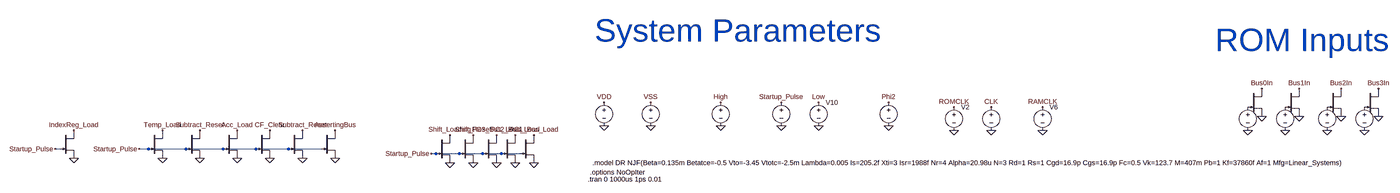
[diagram p0: schematic controls.asc, whole sheet]
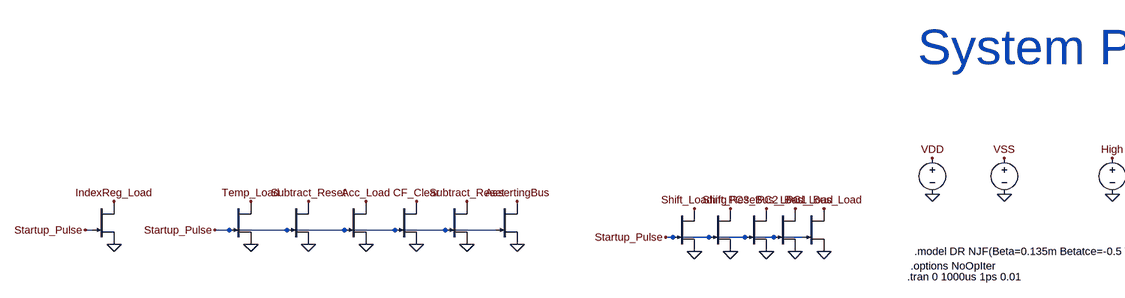
[diagram p1: schematic controls.asc, part, row 1 of 1, column 1 of 2]
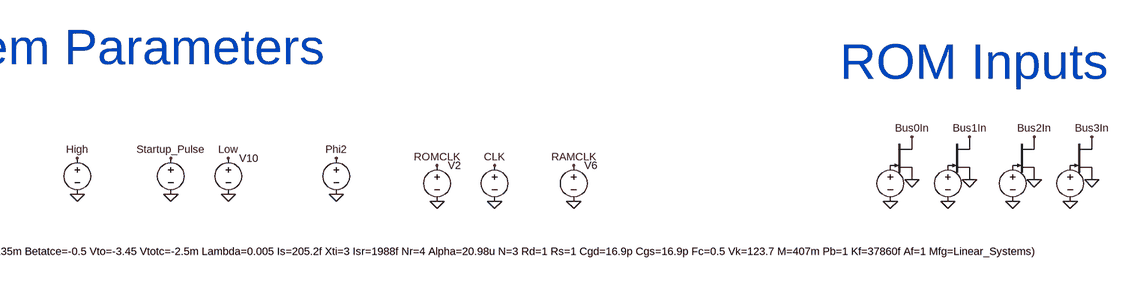
[diagram p2: schematic controls.asc, part, row 1 of 1, column 2 of 2]
controls.asc, the LTspice schematic file:
Version 4.1
SHEET 1 109444 42780
WIRE 6160 -9552 6144 -9552
WIRE 6464 -9552 6432 -9552
WIRE 6592 -9552 6464 -9552
WIRE 6720 -9552 6592 -9552
WIRE 6832 -9552 6720 -9552
WIRE 6944 -9552 6832 -9552
WIRE 7056 -9552 6944 -9552
WIRE 7488 -9536 7472 -9536
WIRE 7568 -9536 7488 -9536
WIRE 7648 -9536 7568 -9536
WIRE 7712 -9536 7648 -9536
WIRE 7776 -9536 7712 -9536
FLAG 8768 -9632 0
FLAG 8608 -9712 VDD
FLAG 8608 -9632 0
FLAG 8768 -9712 VSS
FLAG 6432 -9552 Startup_Pulse
FLAG 6512 -9616 Temp_Load
FLAG 6768 -9616 Acc_Load
FLAG 6880 -9616 CF_Clear
FLAG 6640 -9616 Subtract_Reset
FLAG 6768 -9520 0
FLAG 6512 -9520 0
FLAG 6880 -9520 0
FLAG 6640 -9520 0
FLAG 9008 -9632 0
FLAG 9008 -9712 High
FLAG 6992 -9616 Subtract_Reset
FLAG 6992 -9520 0
FLAG 7104 -9616 AssertingBus
FLAG 7104 -9520 0
FLAG 7472 -9536 Startup_Pulse
FLAG 7536 -9504 0
FLAG 7536 -9600 Shift_Loading
FLAG 7616 -9504 0
FLAG 7616 -9600 Shift_Reset
FLAG 6208 -9616 IndexReg_Load
FLAG 6144 -9552 Startup_Pulse
FLAG 6208 -9520 0
FLAG 7824 -9600 PC1_Bus_Load
FLAG 7760 -9600 PC2_Bus_Load
FLAG 7696 -9600 PC3_Bus_Load
FLAG 7696 -9504 0
FLAG 7760 -9504 0
FLAG 7824 -9504 0
FLAG 9344 -9632 0
FLAG 9344 -9712 Low
FLAG 9584 -9632 0
FLAG 9584 -9712 Phi2
FLAG 9808 -9616 0
FLAG 9808 -9696 ROMCLK
FLAG 9936 -9616 0
FLAG 9936 -9696 CLK
FLAG 10112 -9616 0
FLAG 10112 -9696 RAMCLK
FLAG 9216 -9712 Startup_Pulse
FLAG 9216 -9632 0
FLAG 10864 -9760 Bus0In
FLAG 10816 -9616 0
FLAG 10864 -9664 0
FLAG 10944 -9616 0
FLAG 10992 -9664 0
FLAG 11088 -9616 0
FLAG 11136 -9664 0
FLAG 11216 -9616 0
FLAG 11264 -9664 0
FLAG 10992 -9760 Bus1In
FLAG 11136 -9760 Bus2In
FLAG 11264 -9760 Bus3In
SYMBOL voltage 8608 -9728 R0
WINDOW 0 48 34 Invisible 2
WINDOW 3 53 69 Invisible 2
WINDOW 123 0 0 Left 0
WINDOW 39 0 0 Left 0
SYMATTR InstName V4
SYMATTR Value 24
SYMBOL voltage 8768 -9728 R0
WINDOW 123 0 0 Left 0
WINDOW 39 0 0 Left 0
WINDOW 0 37 46 Invisible 2
WINDOW 3 43 75 Invisible 2
SYMATTR InstName V5
SYMATTR Value -20
SYMBOL njf 6720 -9616 R0
WINDOW 0 19 44 Invisible 2
WINDOW 3 28 43 Invisible 2
SYMATTR InstName J_A6374
SYMATTR Value DR
SYMBOL njf 6464 -9616 R0
WINDOW 0 27 42 Invisible 2
WINDOW 3 31 43 Invisible 2
SYMATTR InstName J_A6375
SYMATTR Value DR
SYMBOL njf 6832 -9616 R0
WINDOW 0 20 138 Invisible 2
WINDOW 3 32 144 Invisible 2
SYMATTR InstName J_A6376
SYMATTR Value DR
SYMBOL njf 6592 -9616 R0
WINDOW 0 25 44 Invisible 2
WINDOW 3 29 48 Invisible 2
SYMATTR InstName J_A6377
SYMATTR Value DR
SYMBOL voltage 9008 -9728 R0
WINDOW 123 0 0 Left 0
WINDOW 39 0 0 Left 0
WINDOW 0 39 38 Invisible 2
WINDOW 3 43 75 Invisible 2
SYMATTR InstName V7
SYMATTR Value PULSE(-3.6 -800m 11u 1ns 1ns 50 50 1)
SYMBOL njf 6944 -9616 R0
WINDOW 0 21 40 Invisible 2
WINDOW 3 31 44 Invisible 2
SYMATTR InstName J_A6378
SYMATTR Value DR
SYMBOL njf 7056 -9616 R0
WINDOW 0 31 41 Invisible 2
WINDOW 3 26 43 Invisible 2
SYMATTR InstName J_A6381
SYMATTR Value DR
SYMBOL njf 7488 -9600 R0
WINDOW 0 31 155 Invisible 2
WINDOW 3 61 170 Invisible 2
SYMATTR InstName J_B2379
SYMATTR Value DR
SYMBOL njf 7568 -9600 R0
WINDOW 0 -41 157 Invisible 2
WINDOW 3 -11 163 Invisible 2
SYMATTR InstName J_B2380
SYMATTR Value DR
SYMBOL njf 6160 -9616 R0
WINDOW 0 27 44 Invisible 2
WINDOW 3 28 43 Invisible 2
SYMATTR InstName J_A6389
SYMATTR Value DR
SYMBOL njf 7648 -9600 R0
WINDOW 0 -121 172 Invisible 2
WINDOW 3 -84 167 Invisible 2
SYMATTR InstName J_A6398
SYMATTR Value DR
SYMBOL njf 7712 -9600 R0
WINDOW 0 -189 164 Invisible 2
WINDOW 3 -151 161 Invisible 2
SYMATTR InstName J_A6399
SYMATTR Value DR
SYMBOL njf 7776 -9600 R0
WINDOW 0 -232 156 Invisible 2
WINDOW 3 -205 155 Invisible 2
SYMATTR InstName J_A6400
SYMATTR Value DR
SYMBOL voltage 9344 -9728 R0
WINDOW 3 24 96 Invisible 2
WINDOW 123 0 0 Left 0
WINDOW 39 0 0 Left 0
SYMATTR Value PULSE(-800m -3.6 0 1n 1n 50 50 1)
SYMATTR InstName V10
SYMBOL voltage 9584 -9728 R0
WINDOW 123 0 0 Left 0
WINDOW 39 0 0 Left 0
WINDOW 0 39 38 Invisible 2
WINDOW 3 43 75 Invisible 2
SYMATTR InstName V1
SYMATTR Value PULSE(-3.6 -800m 13us 1ns 1ns 2us 10us 1)
SYMBOL voltage 9808 -9712 R0
WINDOW 123 0 0 Left 0
WINDOW 39 0 0 Left 0
WINDOW 3 24 96 Invisible 2
SYMATTR Value PULSE(-3.6 -800m 8u 1n 1n 5us 10us 0)
SYMATTR InstName V2
SYMBOL voltage 9936 -9712 R0
WINDOW 123 0 0 Left 0
WINDOW 39 0 0 Left 0
WINDOW 0 39 38 Invisible 2
WINDOW 3 43 75 Invisible 2
SYMATTR InstName V3
SYMATTR Value PULSE(-3.6 -800m 10u 1ns 1ns 5us 10us 10000000000000)
SYMBOL voltage 10112 -9712 R0
WINDOW 123 0 0 Left 0
WINDOW 39 0 0 Left 0
WINDOW 3 24 96 Invisible 2
SYMATTR Value PULSE(-3.6 -800m 12us 1n 1n 5us 10us 0)
SYMATTR InstName V6
SYMBOL voltage 9216 -9728 R0
WINDOW 123 0 0 Left 0
WINDOW 39 0 0 Left 0
WINDOW 0 39 38 Invisible 2
WINDOW 3 43 75 Invisible 2
SYMATTR InstName V8
SYMATTR Value PULSE(-3.6 -800m 6u 1ns 1ns 9us 10us 1)
SYMBOL voltage 10816 -9712 R0
WINDOW 0 56 32 Invisible 2
WINDOW 3 56 72 Invisible 2
SYMATTR InstName V_D1
SYMATTR Value PWL file=d0in.pwl
SYMBOL njf 10816 -9760 R0
WINDOW 0 31 41 Invisible 2
WINDOW 3 26 43 Invisible 2
SYMATTR InstName J_A1
SYMATTR Value DR
SYMBOL njf 10944 -9760 R0
WINDOW 0 31 41 Invisible 2
WINDOW 3 26 43 Invisible 2
SYMATTR InstName J_A2
SYMATTR Value DR
SYMBOL voltage 10944 -9712 R0
WINDOW 0 56 32 Invisible 2
WINDOW 3 56 72 Invisible 2
WINDOW 123 0 0 Left 0
WINDOW 39 0 0 Left 0
SYMATTR InstName V_D5
SYMATTR Value PWL file=d1in.pwl
SYMBOL voltage 11088 -9712 R0
WINDOW 0 56 32 Invisible 2
WINDOW 3 56 72 Invisible 2
WINDOW 123 0 0 Left 0
WINDOW 39 0 0 Left 0
SYMATTR InstName V_D2
SYMATTR Value PWL file=d2in.pwl
SYMBOL njf 11088 -9760 R0
WINDOW 0 31 41 Invisible 2
WINDOW 3 26 43 Invisible 2
SYMATTR InstName J_A3
SYMATTR Value DR
SYMBOL njf 11216 -9760 R0
WINDOW 0 31 41 Invisible 2
WINDOW 3 26 43 Invisible 2
SYMATTR InstName J_A4
SYMATTR Value DR
SYMBOL voltage 11216 -9712 R0
WINDOW 0 56 32 Invisible 2
WINDOW 3 56 72 Invisible 2
WINDOW 123 0 0 Left 0
WINDOW 39 0 0 Left 0
SYMATTR InstName V_D6
SYMATTR Value PWL file=d3in.pwl
TEXT 8552 -9448 Left 2 !.tran 0 1000us 1ps 0.01
TEXT 8576 -9960 Left 7 ;System Parameters
TEXT 8568 -9504 Left 2 !.model DR NJF(Beta=0.135m Betatce=-0.5 Vto=-3.45 Vtotc=-2.5m Lambda=0.005 Is=205.2f Xti=3 Isr=1988f Nr=4 Alpha=20.98u N=3 Rd=1 Rs=1 Cgd=16.9p Cgs=16.9p Fc=0.5 Vk=123.7 M=407m Pb=1 Kf=37860f Af=1 Mfg=Linear_Systems)
TEXT 8560 -9472 Left 2 !.options NoOpIter
TEXT 10704 -9928 Left 7 ;ROM Inputs

The netlist it stands for:
* controls.asc
V4 VDD 0 24
V5 VSS 0 -20
J_A6374 Acc_Load Startup_Pulse 0 DR
J_A6375 Temp_Load Startup_Pulse 0 DR
J_A6376 CF_Clear Startup_Pulse 0 DR
J_A6377 Subtract_Reset Startup_Pulse 0 DR
V7 High 0 PULSE(-3.6 -800m 11u 1ns 1ns 50 50 1)
J_A6378 Subtract_Reset Startup_Pulse 0 DR
J_A6381 AssertingBus Startup_Pulse 0 DR
J_B2379 Shift_Loading Startup_Pulse 0 DR
J_B2380 Shift_Reset Startup_Pulse 0 DR
J_A6389 IndexReg_Load Startup_Pulse 0 DR
J_A6398 PC3_Bus_Load Startup_Pulse 0 DR
J_A6399 PC2_Bus_Load Startup_Pulse 0 DR
J_A6400 PC1_Bus_Load Startup_Pulse 0 DR
V10 Low 0 PULSE(-800m -3.6 0 1n 1n 50 50 1)
V1 Phi2 0 PULSE(-3.6 -800m 13us 1ns 1ns 2us 10us 1)
V2 ROMCLK 0 PULSE(-3.6 -800m 8u 1n 1n 5us 10us 0)
V3 CLK 0 PULSE(-3.6 -800m 10u 1ns 1ns 5us 10us 10000000000000)
V6 RAMCLK 0 PULSE(-3.6 -800m 12us 1n 1n 5us 10us 0)
V8 Startup_Pulse 0 PULSE(-3.6 -800m 6u 1ns 1ns 9us 10us 1)
V_D1 P001 0 PWL file=d0in.pwl
J_A1 Bus0In P001 0 DR
J_A2 Bus1In P002 0 DR
V_D5 P002 0 PWL file=d1in.pwl
V_D2 P003 0 PWL file=d2in.pwl
J_A3 Bus2In P003 0 DR
J_A4 Bus3In P004 0 DR
V_D6 P004 0 PWL file=d3in.pwl
.model NJF NJF
.model PJF PJF
.lib standard.jft
.tran 0 1000us 1ps 0.01
* System Parameters
.model DR NJF(Beta=0.135m Betatce=-0.5 Vto=-3.45 Vtotc=-2.5m Lambda=0.005 Is=205.2f Xti=3 Isr=1988f Nr=4 Alpha=20.98u N=3 Rd=1 Rs=1 Cgd=16.9p Cgs=16.9p Fc=0.5 Vk=123.7 M=407m Pb=1 Kf=37860f Af=1 Mfg=Linear_Systems)
.options NoOpIter
* ROM Inputs
.backanno
.end